# Altium project Cubesat_PDM.PrjPcb (part 3 of 3)
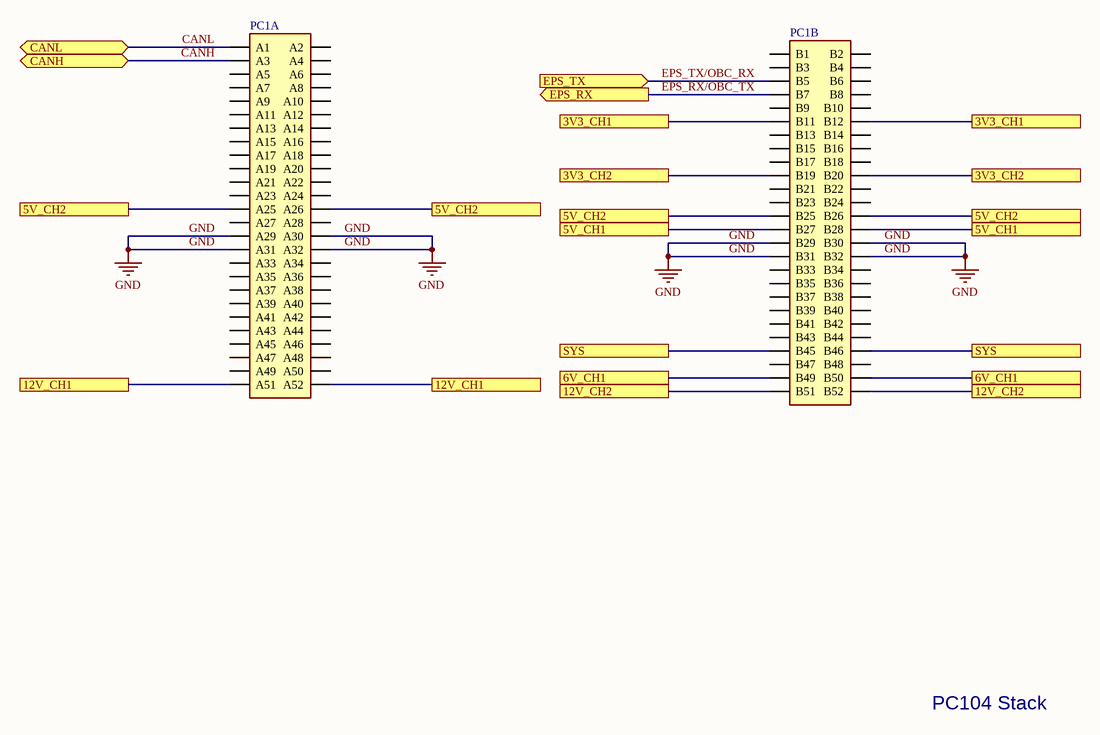
[diagram p11: PC104.SchDoc]

## Nets that join several sheets
+3V3: Controller (25 pins), I2C_Buffer (8 pins), 3V3_Supply (16 pins), 6V_Supply (R37.2), PDM/Ideal_Diode0 (R3A.2), PDM/Ideal_Diode1 (R3B.2), PDM/Ideal_Diode2 (R3C.2), PDM/Ideal_Diode3 (R3D.2)
+3V3A: Controller (5 pins), 12V_Supply (6 pins), 3V3_Supply (6 pins), 6V_Supply (C111.2 C112.2 U12.5 U13.5), 5V_Supply (6 pins), PDM/Heater_1 (C89A.2 U28A.5), PDM/Heater_2 (C89B.2 U28B.5)
+5V: 5V_Supply (17 pins), PDM/Heater_1 (C88A.2 U27A.1), PDM/Heater_2 (C88B.2 U27B.1)
GND: Top_Level (MECH1.1 MECH2.1 MECH3.1 MECH4.1), PDM (18 pins), Controller (37 pins), I2C_Buffer (C90.1 U29.4), 12V_Supply (43 pins), 3V3_Supply (42 pins), 6V_Supply (29 pins), PDM/Ideal_Diode0 (10 pins), PDM/Ideal_Diode1 (10 pins), PDM/Ideal_Diode2 (10 pins), PDM/Ideal_Diode3 (10 pins), 5V_Supply (43 pins), PDM/Heater_1 (8 pins), PDM/Heater_2 (8 pins), PC104 (8 pins)
CANH: Controller (D1.1 L1.4 R10.2), PC104 (PC1.A3)
CANL: Controller (D1.2 L1.3 R11.1), PC104 (PC1.A1)
EPS_RX/OBC_TX: Controller (U3.38), PC104 (PC1.B7)
EPS_TX/OBC_RX: Controller (U3.39), PC104 (PC1.B5)
NetC1A_2: PDM/Ideal_Diode0 (C1A.2 R1A.2 U1A.5), PDM/Ideal_Diode1 (C1B.2 R1B.2 U1B.5), PDM/Ideal_Diode2 (C1C.2 R1C.2 U1C.5), PDM/Ideal_Diode3 (C1D.2 R1D.2 U1D.5)
NetC2A_2: PDM/Ideal_Diode0 (C2A.2 C101A.2 R5A.2 U1A.6), PDM/Ideal_Diode1 (C2B.2 C101B.2 R5B.2 U1B.6), PDM/Ideal_Diode2 (C2C.2 C101C.2 R5C.2 U1C.6), PDM/Ideal_Diode3 (C2D.2 C101D.2 R5D.2 U1D.6)
NetC7_2: Controller (U3.32), 3V3_Supply (C7.2 R7.2)
NetC8_2: Controller (U3.31), 3V3_Supply (C8.2 R94.2)
NetC10_2: Controller (U3.29), 6V_Supply (C10.2 R95.2)
NetC26_2: 12V_Supply (C55.2 C56.2 C57.2 U15.3), 3V3_Supply (5 pins), 6V_Supply (C43.2 C44.2 C45.2 U11.3), 5V_Supply (C71.2 C73.2 C74.2 U21.3), PC104 (PC1.B45 PC1.B46)
NetC91_2: Controller (U3.15), 12V_Supply (C91.2 R96.2)
NetC92_2: Controller (U3.25), 12V_Supply (C92.2 R97.2)
NetC93_2: Controller (U3.26), 5V_Supply (C93.2 R98.2)
NetC94_2: Controller (U3.30), 5V_Supply (C94.2 R99.2)
NetC102_2: 3V3_Supply (C102.2 C124.2 U10.10), PC104 (PC1.B19 PC1.B20)
NetC103_2: 3V3_Supply (C103.2 C125.2 U9.10), PC104 (PC1.B11 PC1.B12)
NetC104_2: 6V_Supply (C104.2 R40.2 U14.6), PC104 (PC1.B49 PC1.B50)
NetC105_2: 12V_Supply (C105.2 C109.2 U19.10), PC104 (PC1.A51 PC1.A52)
NetC106_2: 12V_Supply (C106.2 C110.2 U20.10), PC104 (PC1.B51 PC1.B52)
NetC107_2: 5V_Supply (C107.2 C122.2 U25.10), PC104 (PC1.B27 PC1.B28)
NetC108_2: 5V_Supply (C108.2 C123.2 U26.10), PC104 (PC1.A25 PC1.A26 PC1.B25 PC1.B26)
NetR3A_1: PDM/Ideal_Diode0 (R3A.1 U1A.3), PDM/Ideal_Diode1 (R3B.1 U1B.3), PDM/Ideal_Diode2 (R3C.1 U1C.3), PDM/Ideal_Diode3 (R3D.1 U1D.3)
NetR30_2: Controller (U3.42), 6V_Supply (R30.2 R85.2)
NetR37_1: Controller (U3.43), 6V_Supply (R37.1 U14.3)
NetR70A_2: PDM/Heater_1 (R70A.2 U27A.3), PDM/Heater_2 (R70B.2 U27B.3)
NetR72A_1: PDM/Heater_1 (R72A.1), PDM/Heater_2 (R72B.1)
NetR73A_2: PDM/Heater_1 (R73A.2 U28A.1), PDM/Heater_2 (R73B.2 U28B.1)
NetR84_2: Controller (U3.37), 6V_Supply (R84.2 U11.2)
NetR86_2: Controller (U3.95), 12V_Supply (R86.2 U15.2)
NetR87_2: Controller (U3.61), 5V_Supply (R87.2 U21.2)
NetR88_2: Controller (U3.97), 12V_Supply (R88.2 U19.5)
NetR89_2: Controller (U3.41), 12V_Supply (R89.2 U20.5)
NetR90_2: Controller (U3.45), 5V_Supply (R90.2 U25.5)
NetR91_2: Controller (U3.34), 5V_Supply (R91.2 U26.5)
NetR92_2: Controller (U3.58), 3V3_Supply (R92.2 U9.5)
NetR93_2: Controller (U3.56), 3V3_Supply (R93.2 U10.5)
NetR100A_2: PDM/Ideal_Diode0 (R100A.2 U1A.1), PDM/Ideal_Diode1 (R100B.2 U1B.1), PDM/Ideal_Diode2 (R100C.2 U1C.1), PDM/Ideal_Diode3 (R100D.2 U1D.1)
NetU3_23: Controller (U3.23), 6V_Supply (U12.1 U12.4)
NetU3_24: Controller (U3.24), 12V_Supply (U16.1 U16.4)
NetU3_33: Controller (U3.33), 5V_Supply (U26.4)
NetU3_35: Controller (U3.35), 3V3_Supply (U6.1 U6.4)
NetU3_36: Controller (U3.36), 5V_Supply (U22.1 U22.4)
NetU3_40: Controller (U3.40), 12V_Supply (U20.4)
NetU3_44: Controller (U3.44), 5V_Supply (U25.4)
NetU3_55: Controller (U3.55), 3V3_Supply (U10.4)
NetU3_57: Controller (U3.57), 3V3_Supply (U9.4)
NetU3_98: Controller (U3.98), 12V_Supply (U19.4)